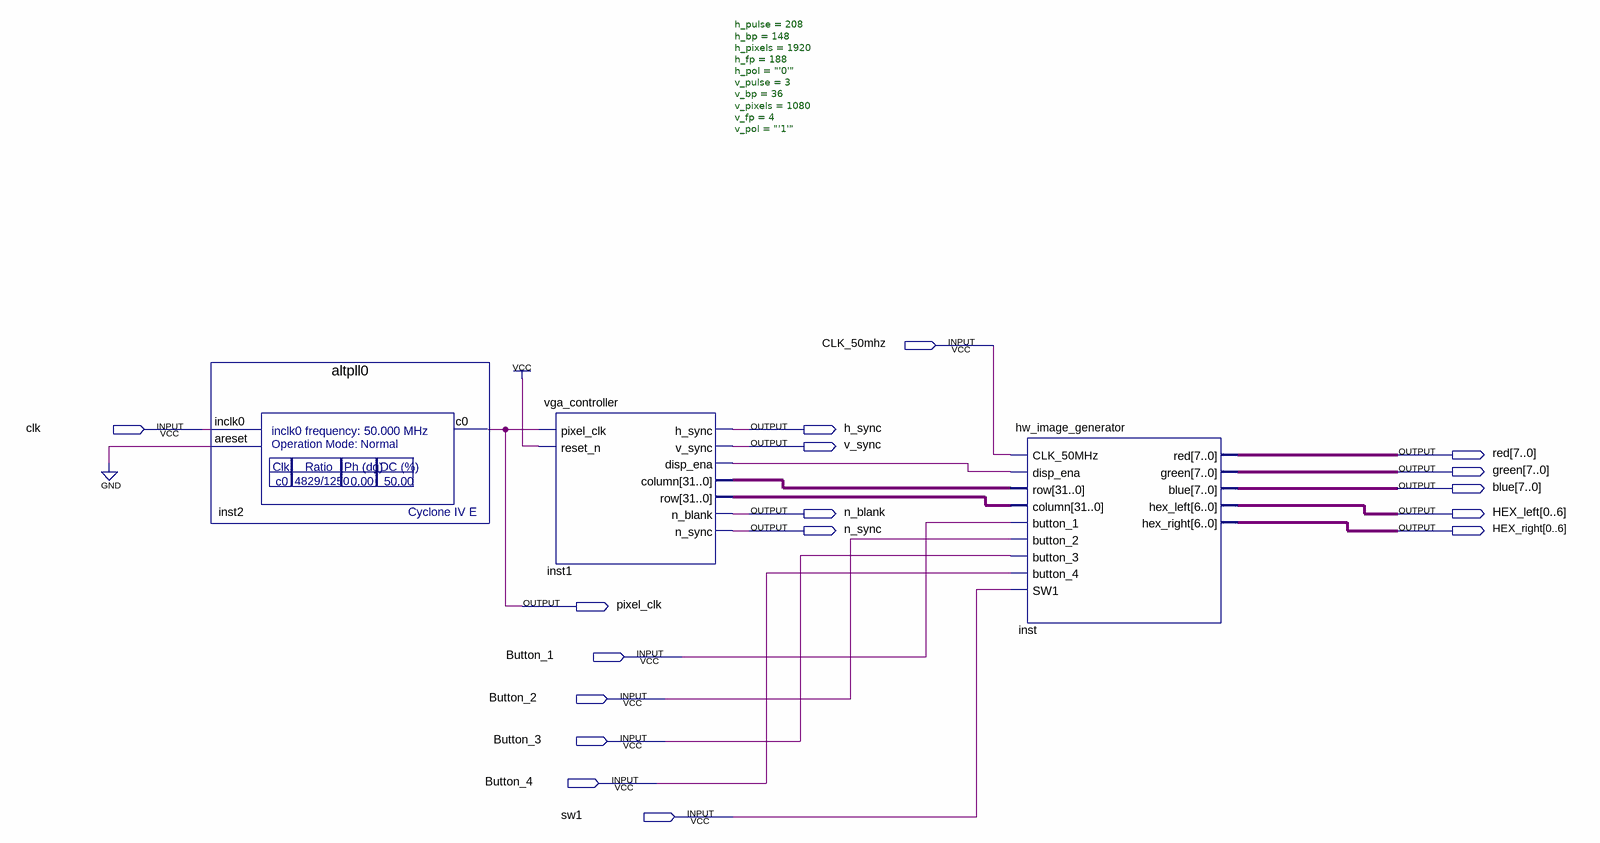
[diagram p0: schematic sheet]
// Quartus schematic vga_with_hw_test_image.bdf as structural Verilog: 3 symbols, 17 pins
module vga_with_hw_test_image (
  input  CLK_50mhz,
  input  clk,
  input  Button_1,
  input  Button_2,
  input  Button_3,
  input  Button_4,
  input  sw1,
  output h_sync,
  output v_sync,
  output [7:0] red,
  output [7:0] green,
  output [7:0] blue,
  output n_blank,
  output [0:6] HEX_left,
  output n_sync,
  output [0:6] HEX_right,
  output pixel_clk
);

  wire inst1_disp_ena;
  wire [31:0] inst1_column, inst1_row;

  altpll0 inst2 (.inclk0(clk), .areset(1'b0), .c0(pixel_clk));
  vga_controller #(.h_pulse(208), .h_bp(148), .h_pixels(1920), .h_fp(188), .h_pol("'0'"), .v_pulse(3), .v_bp(36), .v_pixels(1080), .v_fp(4), .v_pol("'1'")) inst1 (
    .pixel_clk(pixel_clk), .reset_n(1'b1), .h_sync(h_sync), .v_sync(v_sync), .disp_ena(inst1_disp_ena),
    .column(inst1_column), .row(inst1_row), .n_blank(n_blank), .n_sync(n_sync));
  hw_image_generator inst (
    .CLK_50MHz(CLK_50mhz), .disp_ena(inst1_disp_ena), .row(inst1_column), .column(inst1_row),
    .button_1(Button_1), .button_2(Button_2), .button_3(Button_3), .button_4(Button_4), .SW1(sw1), .red(red),
    .green(green), .blue(blue), .hex_left(HEX_left), .hex_right(HEX_right));
endmodule
